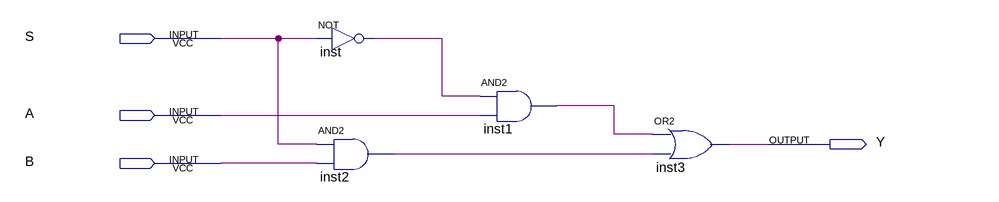
[diagram p0: schematic sheet]
// Quartus schematic LAB2.bdf as structural Verilog: 4 symbols, 4 pins
module LAB2 (
  input  S,
  input  A,
  input  B,
  output Y
);

  wire inst1_out, inst2_out, inst_out;

  not inst (inst_out, S);
  and inst2 (inst2_out, S, B);
  and inst1 (inst1_out, inst_out, A);
  or inst3 (Y, inst1_out, inst2_out);
endmodule
